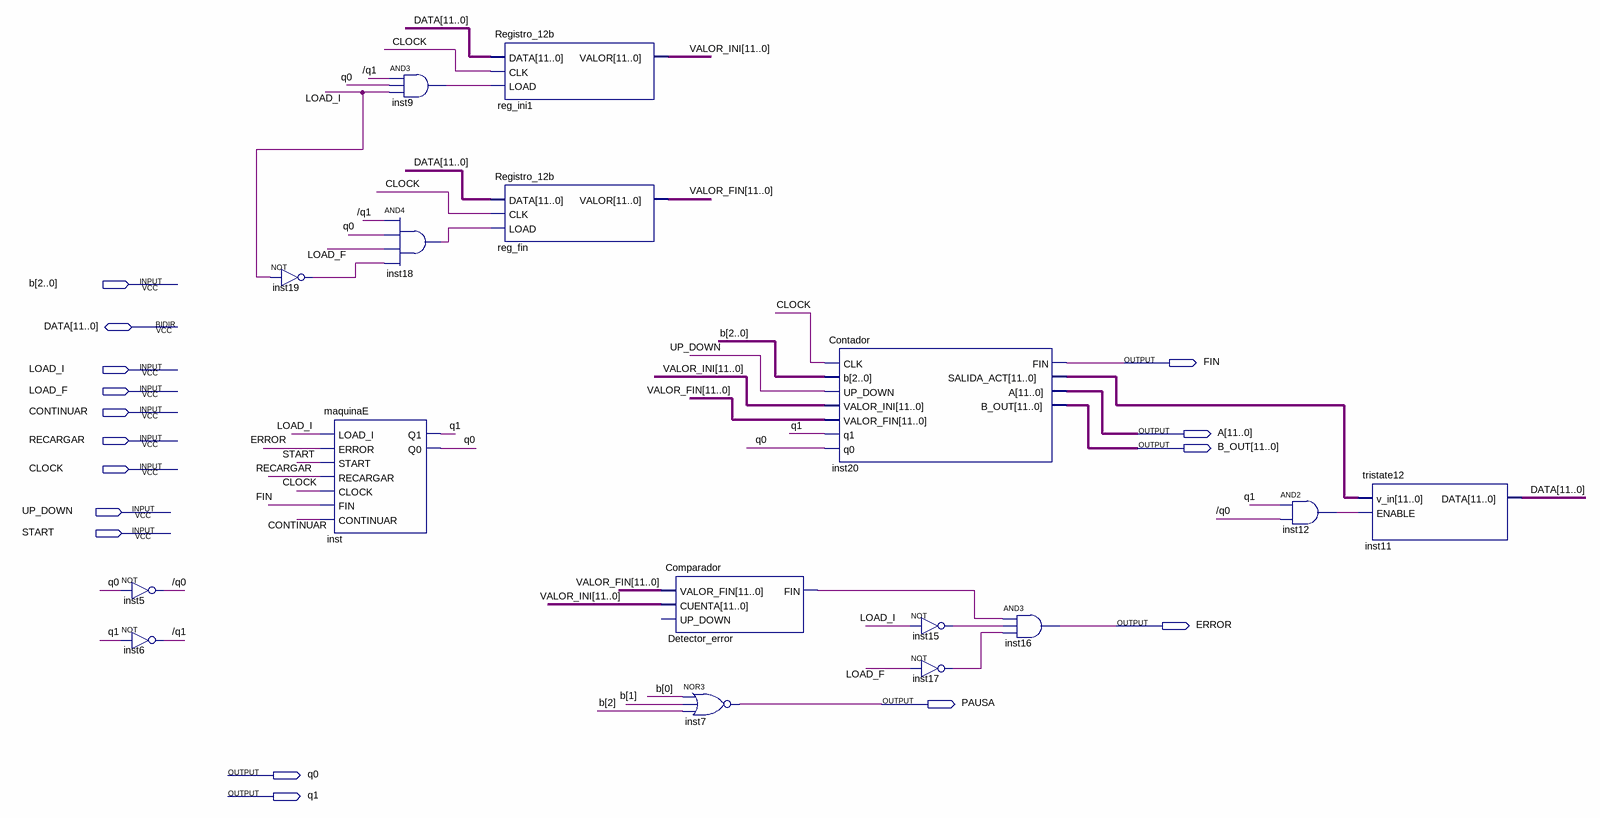
[diagram p0: schematic sheet]
// Quartus schematic top.bdf as structural Verilog: 16 symbols, 16 pins
module top (
  input  [2:0] b,
  input  LOAD_I,
  input  LOAD_F,
  input  CONTINUAR,
  input  RECARGAR,
  input  CLOCK,
  input  UP_DOWN,
  input  START,
  inout  [11:0] DATA,
  output FIN,
  output [11:0] A,
  output [11:0] B_OUT,
  output ERROR,
  output PAUSA,
  output q0,
  output q1
);

  wire \/q0 , \/q1 , Detector_error_fin, inst9_out, inst12_out, inst15_out, inst17_out, inst18_out,
       inst19_out;
  wire [11:0] inst20_salida_act, VALOR_FIN, VALOR_INI;

  not inst5 (\/q0 , q0);
  not inst6 (\/q1 , q1);
  not inst19 (inst19_out, LOAD_I);
  maquinaE inst (
    .LOAD_I(LOAD_I), .ERROR(ERROR), .START(START), .RECARGAR(RECARGAR), .CLOCK(CLOCK), .FIN(FIN),
    .CONTINUAR(CONTINUAR), .Q1(q1), .Q0(q0));
  and inst9 (inst9_out, \/q1 , q0, LOAD_I);
  and inst18 (inst18_out, \/q1 , q0, LOAD_F, inst19_out);
  Registro_12b reg_ini1 (.DATA(DATA), .CLK(CLOCK), .LOAD(inst9_out), .VALOR(VALOR_INI));
  Registro_12b reg_fin (.DATA(DATA), .CLK(CLOCK), .LOAD(inst18_out), .VALOR(VALOR_FIN));
  Comparador Detector_error (.VALOR_FIN(VALOR_FIN), .CUENTA(VALOR_INI), .FIN(Detector_error_fin));  // open: UP_DOWN
  nor inst7 (PAUSA, b[0], b[1], b[2]);
  Contador inst20 (
    .CLK(CLOCK), .b(b), .UP_DOWN(UP_DOWN), .VALOR_INI(VALOR_INI), .VALOR_FIN(VALOR_FIN), .q1(q1), .q0(q0),
    .FIN(FIN), .SALIDA_ACT(inst20_salida_act), .A(A), .B_OUT(B_OUT));
  not inst15 (inst15_out, LOAD_I);
  not inst17 (inst17_out, LOAD_F);
  and inst16 (ERROR, Detector_error_fin, inst15_out, inst17_out);
  and inst12 (inst12_out, q1, \/q0 );
  tristate12 inst11 (.v_in(inst20_salida_act), .ENABLE(inst12_out), .DATA(DATA));
endmodule
